# Altium schematic sheet WebCamLight_RevA.SchDoc
size A3; _PRJ_TITLE: PROJECT TITLE; _SHT_TITLE: Sheet; _REV: A; PageSetup: Record=PageOptions|CenterHorizontal=True|CenterVertical=True|PrintScale=0.71|XCorrection=1.00|YCorrection=1.00|PrintKind=0|BorderSize=5000000|LeftOffset=0|BottomOffset=0|Orientation=2|PaperLength=1000|PaperWidth=1000|Scale=100|PaperSource=258|PrintQuality=600|MediaType=1|DitherType=10|PaperKind=A3 (297x420mm)|PrintScaleMode=1
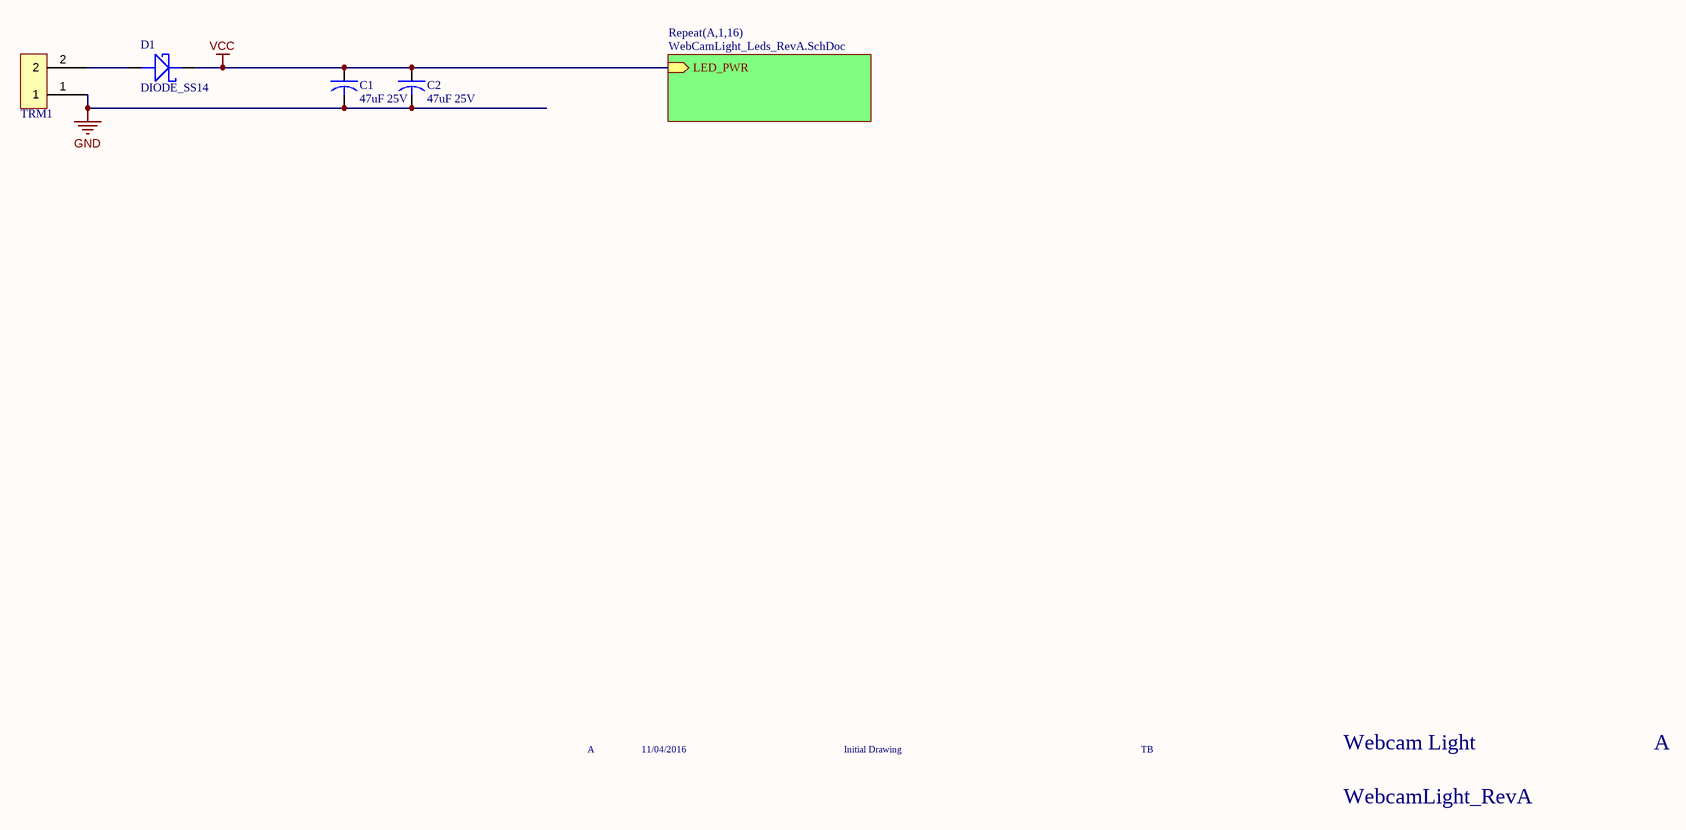
[diagram p0: WebCamLight_RevA.SchDoc]

## Parts
C1  47uF 25V  [1206]
C2  47uF 25V  [1206]
D1  DIODE_SS14  [DO-214AC]
TRM1  Wurth 2way screw terminal  [TERM_2POS_HORIZ_5.08MM]  (value not drawn)

## Sub-sheets
Repeat(A,1,16) = WebCamLight_Leds_RevA.SchDoc: LED_PWR (in)

## Nets
GND: C1.2 C2.2 TRM1.1
VCC: C1.1 C2.1 D1.K ; sheet Repeat(A,1,16)/LED_PWR
NetD1_A: D1.A TRM1.2

## Notes on the sheet
- A
- 11/04/2016
- Initial Drawing
- TB
- Webcam Light
- WebcamLight_RevA
- TEMPLATE MODIFIED 09/04/16
- PCBA REV
- DATE
- ECO
- DESCRIPTION
- DRAWN
- APPROVED
- FILE NAME
- PCB REVISION
- Sheet NAME
- SCALE
- SHEET
- NTS
- SHEET SIZE
- A3

## Library data of the parts
C1 C2 = CAP_47uF_25V_20%_1206: CAP CER 47uF 25V 20% X5R 1206; Manufacturer: TDK Corporation; Manufacturer P/N: C3216JB1E476M160AC
D1 = DIODE_SS14: Schottky Diode, 1A, 40V SS14; Manufacturer: Fairchild; Manufacturer P/N: SS14
TRM1 = TRM_2way_ScrewTerminal: TERM BLOCK 2POS HORIZ 5.08MM T/H; Manufacturer: Wurth Electronics Inc; Manufacturer P/N: 691216510002